# Altium schematic sheet PSFB_transformer.SchDoc
size 594 x 420 mm
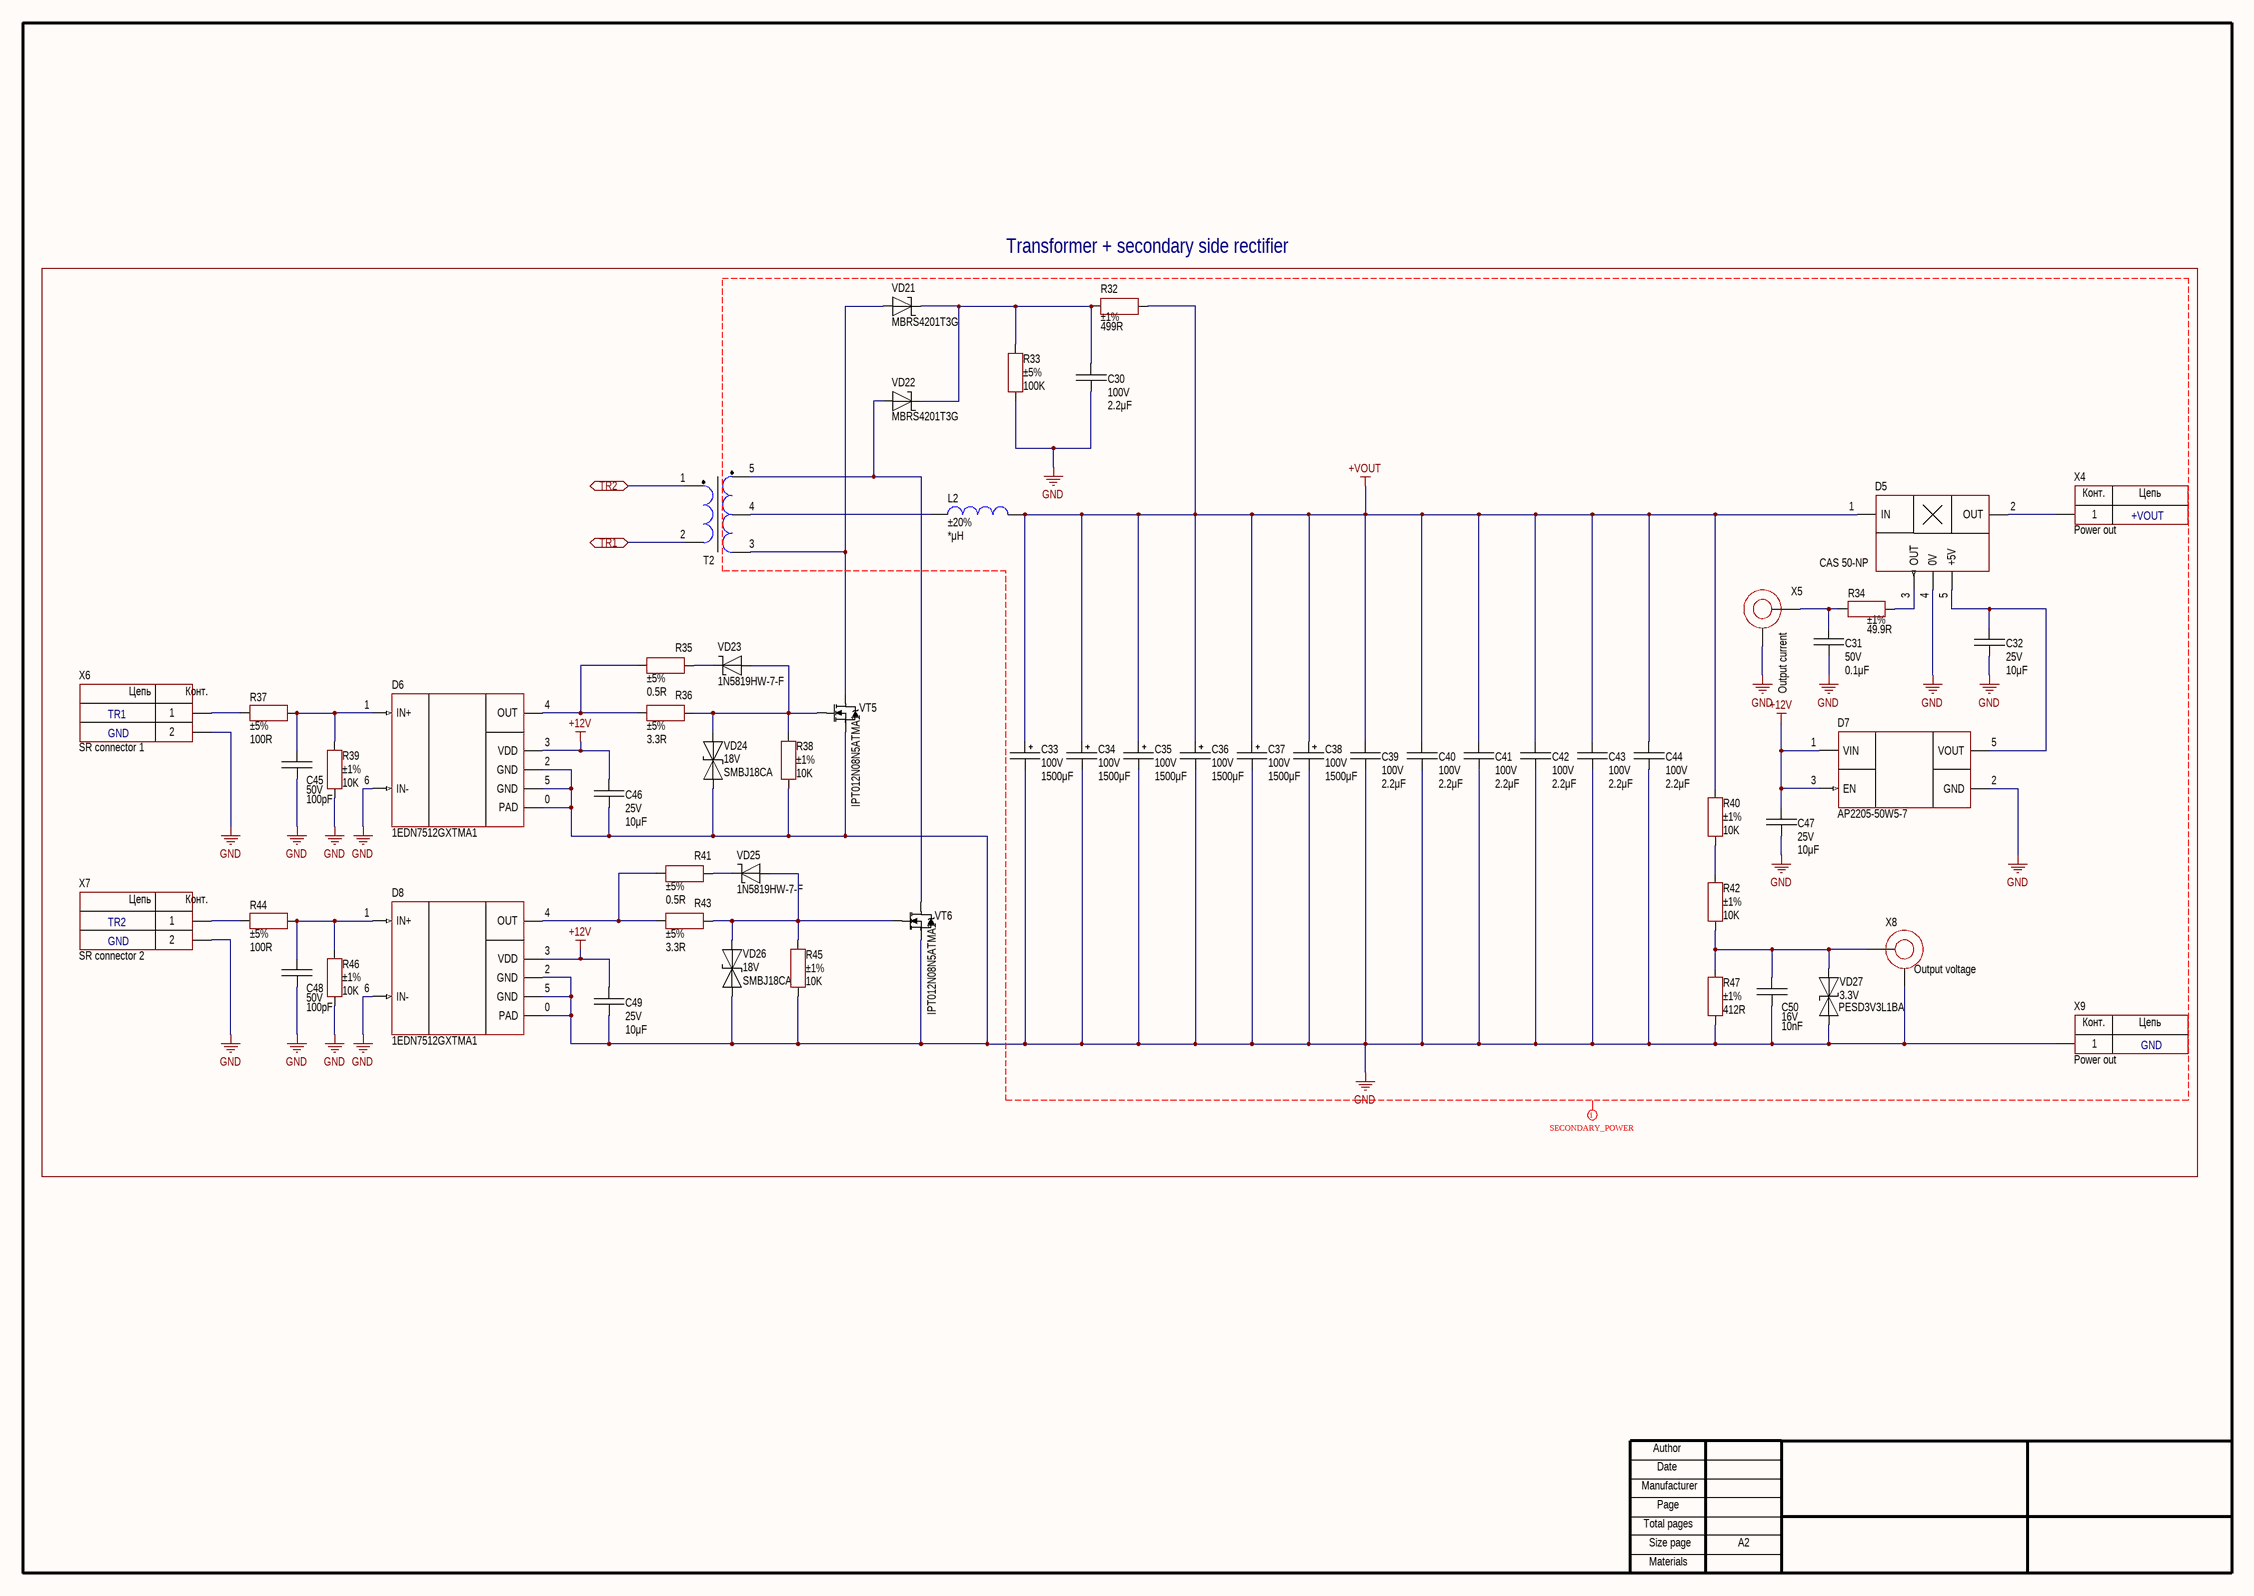
[diagram p0: PSFB_transformer.SchDoc]

## Parts
C30  value 2.2μF  Voltage: 100V  [CAP: 1206]
C31  value 0.1μF  Voltage: 50V  [CAP: 0805]
C32  value 10μF  Voltage: 25V  [CAP: 1206]
C33  value 1500μF  Voltage: 100V  [CAP: D30C10H37]
C34  value 1500μF  Voltage: 100V  [CAP: D30C10H37]
C35  value 1500μF  Voltage: 100V  [CAP: D30C10H37]
C36  value 1500μF  Voltage: 100V  [CAP: D30C10H37]
C37  value 1500μF  Voltage: 100V  [CAP: D30C10H37]
C38  value 1500μF  Voltage: 100V  [CAP: D30C10H37]
C39  value 2.2μF  Voltage: 100V  [CAP: 1206]
C40  value 2.2μF  Voltage: 100V  [CAP: 1206]
C41  value 2.2μF  Voltage: 100V  [CAP: 1206]
C42  value 2.2μF  Voltage: 100V  [CAP: 1206]
C43  value 2.2μF  Voltage: 100V  [CAP: 1206]
C44  value 2.2μF  Voltage: 100V  [CAP: 1206]
C45  value 100pF  Voltage: 50V  [CAP: 0805]
C46  value 10μF  Voltage: 25V  [CAP: 1206]
C47  value 10μF  Voltage: 25V  [CAP: 1206]
C48  value 100pF  Voltage: 50V  [CAP: 0805]
C49  value 10μF  Voltage: 25V  [CAP: 1206]
C50  value 10nF  Voltage: 16V  [CAP: 0805]
D5  PartNumber: CAS 50-NP  [SENSOR: LTS 25-NP]
D6  PartNumber: 1EDN7512GXTMA1  [6-WDFN]
D7  PartNumber: AP2205-50W5-7  [SOT23-5]
D8  PartNumber: 1EDN7512GXTMA1  [6-WDFN]
L2  value *μH  Tolerance: ±20%  [IND: R46.7/24.1/18 (H)]
R32  value 499R  Tolerance: ±1%  [RES: 2512]
R33  value 100K  Tolerance: ±5%  [RES: 1206]
R34  value 49.9R  Tolerance: ±1%  [RES: 0805]
R35  value 0.5R  Tolerance: ±5%  [RES: 1206]
R36  value 3.3R  Tolerance: ±5%  [RES: 1206]
R37  value 100R  Tolerance: ±5%  [RES: 0805]
R38  value 10K  Tolerance: ±1%  [RES: 0805]
R39  value 10K  Tolerance: ±1%  [RES: 0805]
R40  value 10K  Tolerance: ±1%  [RES: 0805]
R41  value 0.5R  Tolerance: ±5%  [RES: 1206]
R42  value 10K  Tolerance: ±1%  [RES: 0805]
R43  value 3.3R  Tolerance: ±5%  [RES: 1206]
R44  value 100R  Tolerance: ±5%  [RES: 0805]
R45  value 10K  Tolerance: ±1%  [RES: 0805]
R46  value 10K  Tolerance: ±1%  [RES: 0805]
R47  value 412R  Tolerance: ±1%  [RES: 0805]
T2  (no value)  [TRANS: ETD59/31/22_FB]
VD21  PartNumber: MBRS4201T3G  [DIODE: SMC]
VD22  PartNumber: MBRS4201T3G  [DIODE: SMC]
VD23  PartNumber: 1N5819HW-7-F  [DIODE: SOD123]
VD24  Voltage: 18V  PartNumber: SMBJ18CA  [DIODE: SMB]
VD25  PartNumber: 1N5819HW-7-F  [DIODE: SOD123]
VD26  Voltage: 18V  PartNumber: SMBJ18CA  [DIODE: SMB]
VD27  Voltage: 3.3V  PartNumber: PESD3V3L1BA  [DIODE: SOD323]
VT5  PartNumber: IPT012N08N5ATMA1  [8-TDSON]
VT6  PartNumber: IPT012N08N5ATMA1  [8-TDSON]
X4  CommentText: Power out  [7461098_for HAL]
X5  CommentText: Output current  [60311002111526]
X6  CommentText: SR connector 1  [SM02B-SRSS-TB(LF)(SN)]
X7  CommentText: SR connector 2  [SM02B-SRSS-TB(LF)(SN)]
X8  CommentText: Output voltage  [60311002111526]
X9  CommentText: Power out  [7461098_for HAL]

## Ports
TR1 (bidir), TR2 (bidir)

## Nets
+12V: C46.1 C47.1 C49.1 D6.3(VDD) D7.1(VIN) D7.3(EN) D8.3(VDD)
+VOUT: C33.1 C34.1 C35.1 C36.1 C37.1 C38.1 C39.1 C40.1 C41.1 C42.1 C43.1 C44.1 D5.1(IN) L2.1 R32.2 R40.2
GND: C30.2 C31.1 C32.2 C33.2 C34.2 C35.2 C36.2 C37.2 C38.2 C39.2 C40.2 C41.2 C42.2 C43.2 C44.2 C45.1 C46.2 C47.2 C48.1 C49.2 C50.1 D5.4(0V) D6.0(PAD) D6.2(GND) D6.5(GND) D6.6(IN-) D7.2(GND) D8.0(PAD) D8.2(GND) D8.5(GND) D8.6(IN-) R33.1 R38.1 R39.1 R45.1 R46.1 R47.1 VD24.2(C) VD26.2(C) VD27.1(A) VT5.3(S) VT6.3(S) X5.2 X6.2 X7.2 X8.2 X9.1
TR1: T2.2 ; port TR1
TR2: T2.1 ; port TR2
NetC30_1: C30.1 R32.1 R33.2 VD21.2 VD22.2
NetC31_2: C31.2 R34.2 X5.1
NetC32_1: C32.1 D5.5(+5V) D7.5(VOUT)
NetC45_2: C45.2 D6.1(IN+) R37.2 R39.2
NetC48_2: C48.2 D8.1(IN+) R44.2 R46.2
NetC50_2: C50.2 R42.1 R47.2 VD27.2(C) X8.1
NetD5_2: D5.2(OUT) X4.1
NetD5_3: D5.3(OUT) R34.1
NetD6_4: D6.4(OUT) R35.1 R36.1
NetD8_4: D8.4(OUT) R41.1 R43.1
NetL2_2: L2.2 T2.4
NetR35_2: R35.2 VD23.2
NetR36_2: R36.2 R38.2 VD23.1 VD24.1(A) VT5.1(G)
NetR37_1: R37.1 X6.1
NetR40_1: R40.1 R42.2
NetR41_2: R41.2 VD25.2
NetR43_2: R43.2 R45.2 VD25.1 VD26.1(A) VT6.1(G)
NetR44_1: R44.1 X7.1
NetT2_3: T2.3 VD21.1 VT5.2(D)
NetT2_5: T2.5 VD22.1 VT6.2(D)

## Layout directives
net class SECONDARY_POWER: +12V, +VOUT, GND

## Notes on the sheet
- Transformer + secondary side rectifier
- +VOUT
- TR1
- GND
- TR2
- Author
- Manufacturer
- Date
- Page
- Total pages
- Size page
- A2
- Materials
- (in symbol Connector_single_power) Конт.; Цепь
- (in symbol Connector_SM02B-SRSS) Цепь; Конт.

## Library data of the parts
C30 C39-C44 = Ceramic_1206: 2.2µF ±10% 100V Ceramic Capacitor X7R 1206 (3216 Metric); Manufacturer: Yageo; PartNumber: CC1206KKX7R0BB225; ValueManufacturerPartNumber: Ceramic capacitor, 2.2μF, X7R, ±10%, 100V, 1206, -55...+125°C; Package: 1206; HelpURL: https://www.digikey.com/en/products/detail/yageo/CC1206KKX7R0BB225/5884563; Temperature: -55...+125°C; TypeCapacitor: Ceramic capacitor; Tolerance: ±10%; TypeDielectric: X7R
C31 = Ceramic_0805: 0.1µF ±10% 50V Ceramic Capacitor X7R 0805 (2012 Metric); Manufacturer: Yageo; PartNumber: CC0805KRX7R9BB104; ValueManufacturerPartNumber: Ceramic capacitor, 0.1μF, X7R, ±10%, 50V, 0805, -55...+125°C; Package: 0805; HelpURL: https://www.digikey.com/en/products/detail/yageo/CC0805KRX7R9BB104/302874; Temperature: -55...+125°C; TypeCapacitor: Ceramic capacitor; Tolerance: ±10%; TypeDielectric: X7R
C32 C46 C47 C49 = Ceramic_1206: 10µF ±10% 25V Ceramic Capacitor X7R 1206 (3216 Metric); Manufacturer: Yageo; PartNumber: CC1206KKX7R8BB106; ValueManufacturerPartNumber: Ceramic capacitor, 10μF, X7R, ±10%, 25V, 1206, -55...+125°C; Package: 1206; HelpURL: https://www.digikey.com/en/products/detail/yageo/CC1206KKX7R8BB106/5195365; Temperature: -55...+125°C; TypeCapacitor: Ceramic capacitor; Tolerance: ±10%; TypeDielectric: X7R
C33-C38 = Aluminium: 1500µF 100V Aluminum Electrolytic Capacitors Radial, Can - Snap-In  5000 Hrs @ 105°C; Manufacturer: Nichicon; PartNumber: LGY2A152MELB30; TypeCapacitor: Aluminium capacitor; Tolerance: ±20%; Package: 37x30x10 mm; HelpURL: https://www.digikey.com/en/products/detail/nichicon/LGY2A152MELB30/2540916; ValueManufacturerPartNumber: =TypeCapacitor+', '+Value+', '+Voltage+', '+Tolerance+', '+Impedance+', '+Package+', '+Temperature; Temperature: -55...+105°C
C45 C48 = Ceramic_0805: 100pF ±5% 50V Ceramic Capacitor C0G, NP0 0805 (2012 Metric); Manufacturer: Yageo; PartNumber: CC0805JRNPO9BN101; ValueManufacturerPartNumber: Ceramic capacitor, 100pF, NP0, ±10%, 50V, 0805, -55...+125°C; Tolerance: ±10%; Package: 0805; HelpURL: https://www.digikey.com/en/products/detail/yageo/CC0805JRNPO9BN101/302845; Temperature: -55...+125°C; TypeCapacitor: Ceramic capacitor; TypeDielectric: NP0
C50 = Ceramic_0805: 27pF ±5% 50V Ceramic Capacitor C0G, NP0 0805 (2012 Metric); Manufacturer: Yageo; PartNumber: CC0805JKNPO7BN103; ValueManufacturerPartNumber: Ceramic capacitor, 10nF, NP0, ±10%, 16V, 0805, -55...+125°C; Tolerance: ±10%; Package: 0805; HelpURL: https://www.digikey.com/en/products/detail/yageo/CC0805JKNPO7BN103/5884010; Temperature: -55...+125°C; TypeCapacitor: Ceramic capacitor; TypeDielectric: NP0
D5 = LTS 25-NP: Current Sensor 50A 1 Channel Flux Gate, Closed Loop Bidirectional Module; Manufacturer: LEM; ValueManufacturerPartNumber: IC current sensors, 50A, ±0.2%, 400 kHz, 12.5mV/A, -40...+85°C; Supply: 5V; Accuracy: ±0.2%; GainBandwidth: 400 kHz; Sensitivity: 12.5mV/A; HelpURL: https://www.digikey.com/en/products/detail/lem-usa-inc/CAS-50-NP/2038403; Package: Module; ComponentType: IC current sensors; Temperature: -40...+85°C; Sensing: 50A
D6 D8 = 1EDN7512BXTSA1: Low-Side Gate Driver IC Inverting, Non-Inverting PG-WSON-6-1; Manufacturer: Infineon; ValueManufacturerPartNumber: Low gate driver, Non-Inverting, complementary, +4/-8A, 6.5/4.5ns, 4.5...20V, -55...+150°C, 6-WDFN; VoltageSupply: 4.5...20V; Frequency: complementary; CurrentOutput: +4/-8A; CMTI: 6.5/4.5ns; HelpURL: https://www.digikey.com/en/products/detail/infineon-technologies/1EDN7512GXTMA1/6565754; Package: 6-WDFN; ComponentType: Low gate driver; Temperature: -55...+150°C; VoltageWork: Non-Inverting
D7 = AP2204K-3.3TRG1: Linear Voltage Regulator IC Positive Fixed 1 Output  250mA SOT-25; Manufacturer: Diodes Incorporated; ValueManufacturerPartNumber: Linear voltage regulator, input 4...24V, 0.5V, output 5.0V, 0.25A, -40...+85°C, SOT23-6; VoltageInput: input 4...24V; MaxDropout: 0.5V; CurrentOutput: 0.25A; VoltageOutput: output 5.0V; HelpURL: https://www.digikey.com/en/products/detail/diodes-incorporated/AP2205-50W5-7/10294899; Package: SOT23-6; ComponentType: Linear voltage regulator; Temperature: -40...+85°C
L2 = Inductor_R46.7/24.1/18: Custom inductor, DNP; Manufacturer: Magnetics; PartNumber: 0077438A7; ValueManufacturerPartNumber: Fixed inductor, *μH, ±20%, R46.7/24.1/18, Kool Mu, µ=125, 281 нГн/витков2; TypeInductor: Fixed inductor; TypeMatiriel: Kool Mu; AL: 281 нГн/витков2; MaterialPermeability: µ=125; Package: R46.7/24.1/18; HelpURL: http://ferrite.ru/warehouse/r-46-7-24-1-18-77438-a7.html
R32 = Resistor_2512: 499 Ohms ±1% 1W Chip Resistor 2512 (6432 Metric) Moisture Resistant Thick Film; Manufacturer: Yageo; PartNumber: RC2512FK-07499RL; ValueManufacturerPartNumber: Resistor film, 499R, ±1%, 2512, 1W, -55...+125°C; TypeResistor: Resistor film; Package: 2512; HelpURL: https://www.digikey.com/en/products/detail/yageo/RC2512FK-07499RL/5922242; Temperature: -55...+125°C; Power: 1W
R33 = Resistor_1206: 100 kOhms ±5% 0.25W, 1/4W Chip Resistor 1206 (3216 Metric) Moisture Resistant Thick Film; Manufacturer: Yageo; PartNumber: RC1206JR-07100KL; ValueManufacturerPartNumber: Resistor film, 100K, ±5%, 1206, 0.25W, -55...+125°C; TypeResistor: Resistor film; Package: 1206; HelpURL: https://www.digikey.com/en/products/detail/yageo/RC1206JR-07100KL/729207; Temperature: -55...+125°C; Power: 0.25W
R34 = Resistor_0805: 49.9 Ohms ±1% 0.125W, 1/8W Chip Resistor 0805 (2012 Metric) Moisture Resistant Thick Film; Manufacturer: Yageo; PartNumber: RC0805FR-0749R9L; ValueManufacturerPartNumber: Resistor film, 49.9R, ±1%, 0805, 0.125W, -55...+125°C; TypeResistor: Resistor film; Package: 0805; HelpURL: https://www.digikey.com/en/products/detail/yageo/RC0805FR-0749R9L/727984; Temperature: -55...+125°C; Power: 0.125W
R35 R41 = Resistor_1206: 500 mOhms ±5% 0.25W, 1/4W Chip Resistor 1206 (3216 Metric) Automotive AEC-Q200, Current Sense, Moisture Resistant Thick Film; Manufacturer: Yageo; PartNumber: RL1206JR-070R5L; ValueManufacturerPartNumber: Resistor film, 0.5R, ±5%, 1206, 0.25W, -55...+125°C; TypeResistor: Resistor film; Package: 1206; HelpURL: https://www.digikey.com/en/products/detail/yageo/RL1206JR-070R5L/5925150; Temperature: -55...+125°C; Power: 0.25W
R36 R43 = Resistor_1206: 3.3 Ohms ±5% 0.25W, 1/4W Chip Resistor 1206 (3216 Metric) Moisture Resistant Thick Film; Manufacturer: Yageo; PartNumber: RC1206JR-073R3L; ValueManufacturerPartNumber: Resistor film, 3.3R, ±5%, 1206, 0.25W, -55...+125°C; TypeResistor: Resistor film; Package: 1206; HelpURL: https://www.digikey.com/en/products/detail/yageo/RC1206JR-073R3L/729266; Temperature: -55...+125°C; Power: 0.25W
R37 R44 = Resistor_0805: 100 Ohms ±5% 0.125W, 1/8W Chip Resistor 0805 (2012 Metric) Moisture Resistant Thick Film; Manufacturer: Yageo; PartNumber: RC0805JR-07100RL; ValueManufacturerPartNumber: Resistor film, 100R, ±5%, 0805, 0.125W, -55...+125°C; TypeResistor: Resistor film; Package: 0805; HelpURL: https://www.digikey.com/product-detail/en/yageo/RC0805JR-07100RL/311-100ARCT-ND/731185; Temperature: -55...+125°C; Power: 0.125W
R38-R40 R42 R45 R46 = Resistor_0805: 10 kOhms ±1% 0.125W, 1/8W Chip Resistor 0805 (2012 Metric) Moisture Resistant Thick Film; Manufacturer: Yageo; PartNumber: RC0805FR-0710KL; ValueManufacturerPartNumber: Resistor film, 10K, ±1%, 0805, 0.125W, -55...+125°C; TypeResistor: Resistor film; Package: 0805; HelpURL: https://www.digikey.com/en/products/detail/yageo/RC0805FR-0710KL/727535; Temperature: -55...+125°C; Power: 0.125W
R47 = Resistor_0805: 412 Ohms ±1% 0.125W, 1/8W Chip Resistor 0805 (2012 Metric) Moisture Resistant Thick Film; Manufacturer: Yageo; PartNumber: RC0805FR-07412RL; ValueManufacturerPartNumber: Resistor film, 412R, ±1%, 0805, 0.125W, -55...+125°C; TypeResistor: Resistor film; Package: 0805; HelpURL: https://www.digikey.com/en/products/detail/yageo/RC0805FR-07412RL/727946; Temperature: -55...+125°C; Power: 0.125W
T2 = ETD59/31/22_FB: N97 B66397G0000X197 сore / B66398W1024T001 coil former; Manufacturer: Epcos; TypeTransformer: Transformer; HelpURL: https://www.digikey.com/en/products/detail/epcos-tdk-electronics/B66398W1024T001/3914904; ValueManufacturerPartNumber: =TypeTransformer+', '+Package; PartNumber: B66398W1024T001
VD21 VD22 = Schottky_single: Diode Schottky 200V 4A Surface Mount SMC; Manufacturer: Diodes Incorporated; ValueManufacturerPartNumber: Schottky diode, 200V, 1A, 0.45V, 20pF, SMC, -55...+150°C; TypeDiode: Schottky diode; Current: 1A; VoltageDrop: 0.45V; RecoveryTime: 20pF; Package: SMC; HelpURL: https://www.digikey.com/en/products/detail/on-semiconductor/MBRS4201T3G/1087352; Temperature: -55...+150°C; Voltage: 200V
VD23 VD25 = Schottky_single: Diode Schottky 40V 1A Surface Mount SOD-123C; Manufacturer: Diodes Incorporated; ValueManufacturerPartNumber: Schottky diode, 40V, 1A, 0.45V, 15pF, SOD-123, -55...+150°C; TypeDiode: Schottky diode; VoltageDrop: 0.45V; RecoveryTime: 15pF; Package: SOD-123; HelpURL: https://www.digikey.com/en/products/detail/diodes-incorporated/1N5819HW-7-F/814970; Temperature: -55...+150°C; Voltage: 40V; Current: 1A
VD24 VD26 = TVS_single: 29.2V Clamp 20.6A Ipp Tvs Diode Surface Mount DO-214AA (SMBJ); Manufacturer: Diodes Incorporated; Current: 600W; Package: SMB; HelpURL: https://www.digikey.com/en/products/detail/littelfuse-inc/SMBJ18CA/285986; ValueManufacturerPartNumber: =TypeDiode+', '+Voltage+', '+Current+', '+VoltageDrop+', '+RecoveryTime+', '+Package+', '+Temperature; Temperature: -55...+150°C; TypeDiode: TVS diode
VD27 = TVS_single: 3.3V Reverse Standoff 26V Clamp 18A (8/20µs) Ipp Tvs Diode Surface Mount SOD-323; Manufacturer: Diodes Incorporated; Current: 500W; Package: SOD-323; HelpURL: https://www.digikey.com/en/products/detail/nexperia-usa-inc/PESD3V3L1BA-115/1157438; ValueManufacturerPartNumber: =TypeDiode+', '+Voltage+', '+Current+', '+VoltageDrop+', '+RecoveryTime+', '+Package+', '+Temperature; Temperature: -55...+150°C; TypeDiode: TVS diode
VT5 VT6 = MOSFET_N_123: N-Channel 80V 300A (Tc) 375W (Tc) Surface Mount PG-HSOF-8-1; Manufacturer: Infineon Technologies; ValueManufacturerPartNumber: MOSFET N-channel transistor, 100V, 300A, 223nC, 375W, 1.2mOhm, 17000pF, 8-TDSON, -55...+150°C; TypeTransistor: MOSFET N-channel transistor; VoltageDS: 100V; RDS: 1.2mOhm; GateCharge: 223nC; InputCapacitor: 17000pF; Package: 8-TDSON; HelpURL: https://www.digikey.com/en/products/detail/IPT012N08N5ATMA1/IPT012N08N5ATMA1CT-ND/5413752; Temperature: -55...+150°C; CurrentDS: 300A; MaxPower: 375W
X4 X9 = Connector_single_power: 25 Pin Shank Terminal M6 Through Hole; Manufacturer: Würth Elektronik; PartNumber: 7461098; TypeConnector: Power connector; CurrentMax: 250A; HelpURL: https://www.digikey.com/en/products/detail/w%C3%BCrth-elektronik/7461098/2092196; ValueManufacturerPartNumber: =TypeConnector+', '+VoltageMax+', '+CurrentMax
X5 X8 = Connector_SMA: SMA Connector Jack, Female Socket 50Ohm Through Hole Solder; Manufacturer: Würth Elektronik; ValueManufacturerPartNumber: Connector SMA, 50 Ohm, 6Hz; TypeConnector: Connector SMA; Frequency: 6Hz; HelpURL: https://www.we-online.com/catalog/en/WR-SMA_60311002111526; PartNumber: 60311002111526; Impedance: 50 Ohm
X6 X7 = Connector_SM02B-SRSS: Connector Header Surface Mount, Right Angle 2 position 0.039" (1.00mm); Manufacturer: JST; ValueManufacturerPartNumber: Connector, 2pin, 1.00mm, 50V, 25A; VoltageMax: 50V; CurrentMax: 25A; Multichannel: 2pin; HelpURL: https://www.digikey.com/en/products/detail/jst-sales-america-inc/SM02B-SRSS-TB-LF-SN/926708; TypeConnector: Connector; PartNumber: SM02B-SRSS-TB(LF)(SN); Pitch: 1.00mm